# EAGLE design GlucometerV2.1 (EAGLE 7.2.0)
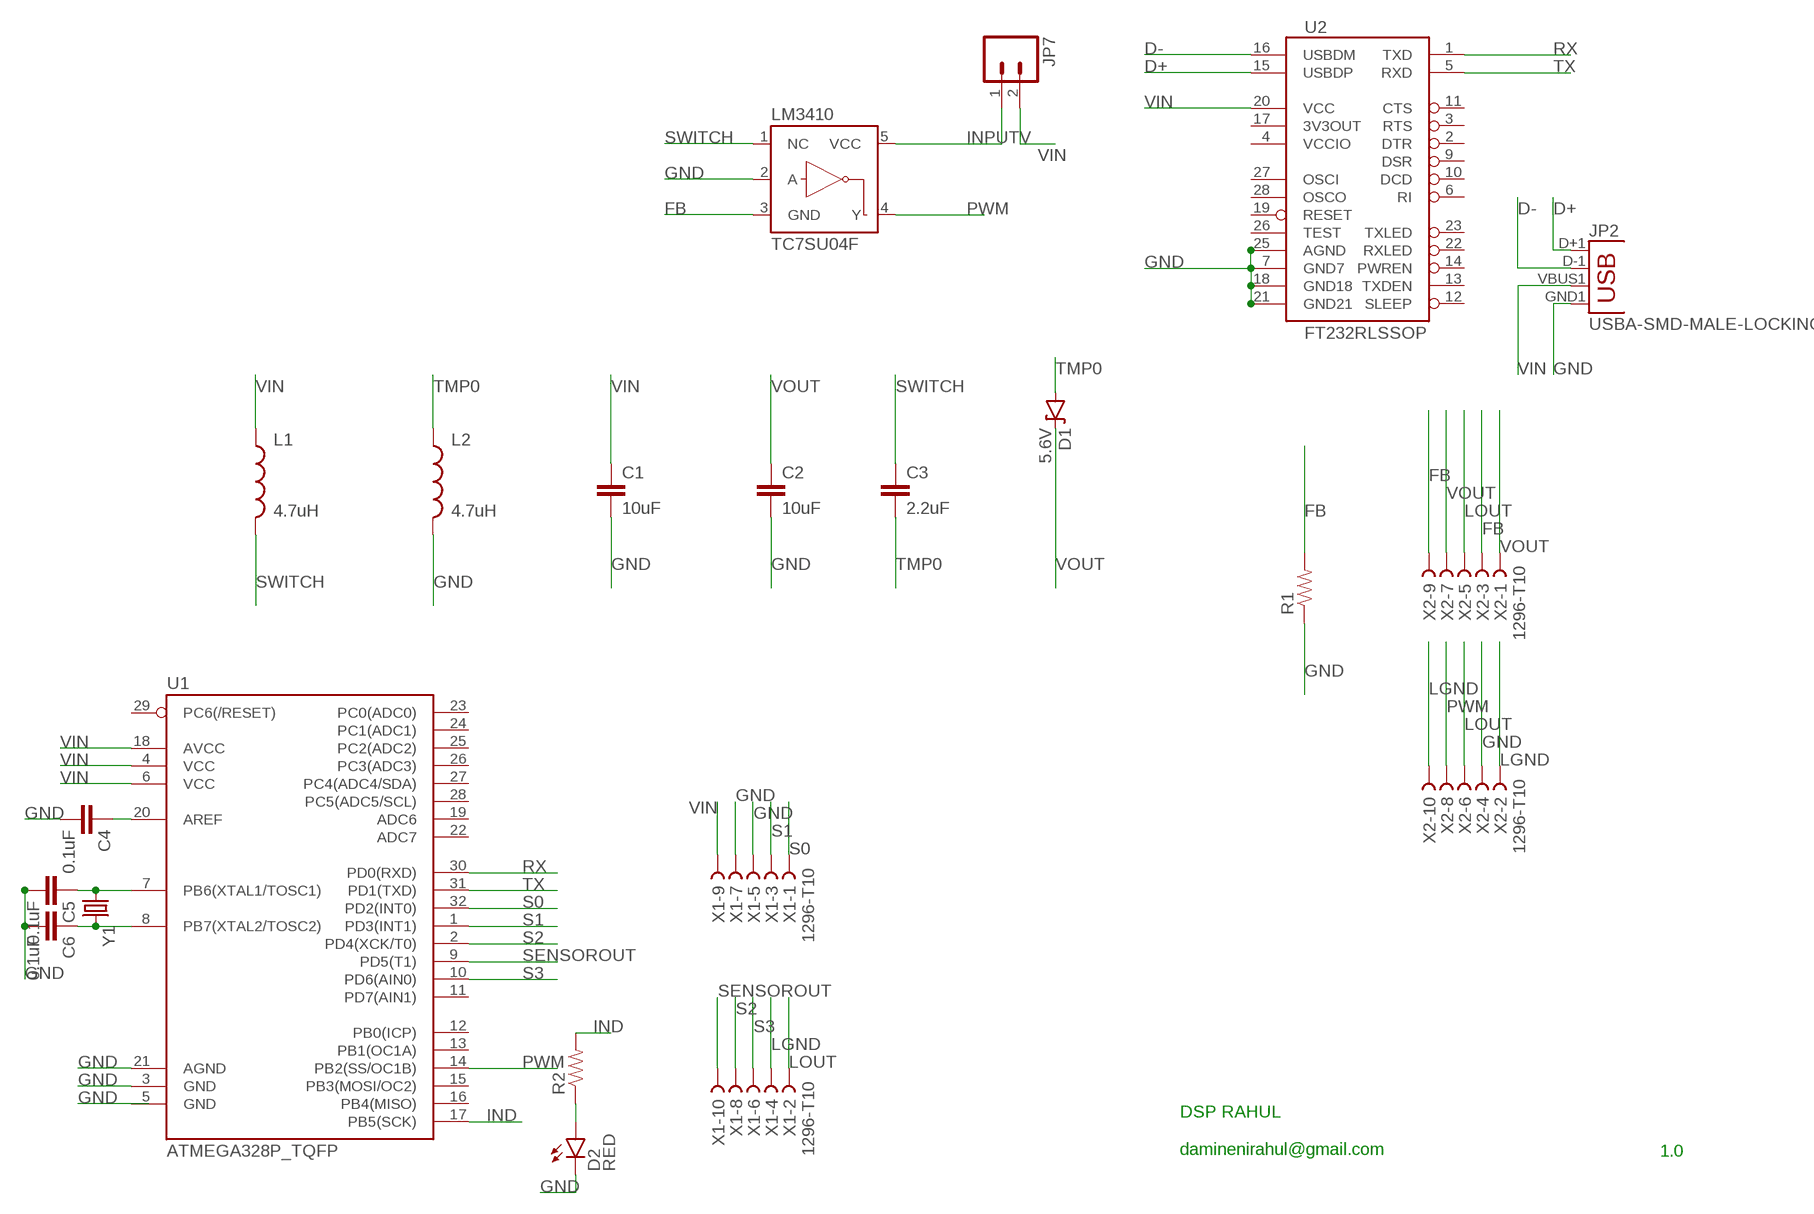
[diagram p0: schematic, sheet 1]

## Parts
C1  10uF  CAP1206  [1206]
C2  10uF  CAP1206  [1206]
C3  2.2uF  CAP1206  [1206]
C4  0.1uF  0.1UF-25V(+80/-20%)(0603)  [0603-CAP]
C5  0.1uF  0.1UF-25V(+80/-20%)(0603)  [0603-CAP]
C6  0.1uF  0.1UF-25V(+80/-20%)(0603)  [0603-CAP]
D1  5.6V  DIODE-ZENER5.6V  [SOD-323]
D2  RED  LED-RED1206  [LED-1206]
JP2  USBA-SMD-MALE-LOCKING  [USB-A-SMT-MALE-LOCKING]
JP7  M02POLAR_LOCK  [MOLEX-1X2_LOCK]
L1  4.7uH  INDUCTOR30OHM,1.8A  [0603]
L2  4.7uH  INDUCTOR30OHM,1.8A  [0603]
LM3410  TC7SU04F  INVERTER_SOT23-5  [SOT23-5]
R1  RESISTOR1206  [1206]
R2  RESISTOR1206  [1206]
U1  ATMEGA328P_TQFP  [TQFP32-08]
U2  FT232RLSSOP  [SSOP28DB]
X1  1296-T10  [1296-10]
X2  1296-T10  [1296-10]
Y1  CRYSTALHC49UV  [HC49U-V]

## Nets
D+: JP2.D+1(D+) U2.15(USBDP)
D-: JP2.D-1(D-) U2.16(USBDM)
FB: LM3410.3(GND) R1.2 X2.3 X2.9
GND: C1.2 C2.2 C4.2 C5.2 C6.2 D2.C JP2.GND1(GND) L2.2 LM3410.2(A) R1.1 U1.3(GND) U1.21(AGND) U2.7(GND7) U2.18(GND18) U2.21(GND21) U2.25(AGND) X1.5 X1.7 X2.4
IND: R2.2 U1.17(PB5(SCK))
INPUTV: JP7.1 LM3410.5(VCC)
LGND: X1.4 X2.2 X2.10
LOUT: X1.2 X2.5 X2.6
N$1: C4.1 U1.20(AREF)
N$2: D2.A R2.1
N$3: C5.1 U1.7(PB6(XTAL1/TOSC1)) Y1.1
N$5: C6.1 U1.8(PB7(XTAL2/TOSC2)) Y1.2
PWM: LM3410.4(Y) U1.14(PB2(SS/OC1B)) X2.8
RX: U1.30(PD0(RXD)) U2.1(TXD)
S0: U1.32(PD2(INT0)) X1.1
S1: U1.1(PD3(INT1)) X1.3
S2: U1.2(PD4(XCK/T0)) X1.8
S3: U1.10(PD6(AIN0)) X1.6
SENSOROUT: U1.9(PD5(T1)) X1.10
SWITCH: C3.1 L1.2 LM3410.1(NC)
TMP0: C3.2 D1.A L2.1
TX: U1.31(PD1(TXD)) U2.5(RXD)
VIN: C1.1 JP2.VBUS1(VBUS) JP7.2 L1.1 U1.4(VCC) U1.6(VCC) U1.18(AVCC) U2.20(VCC) X1.9
VOUT: C2.1 D1.C X2.1 X2.7
Unconnected: U1.5(GND) U1.11(PD7(AIN1)) U1.12(PB0(ICP)) U1.13(PB1(OC1A)) U1.15(PB3(MOSI/OC2)) U1.16(PB4(MISO)) U1.19(ADC6) U1.22(ADC7) U1.23(PC0(ADC0)) U1.24(PC1(ADC1)) U1.25(PC2(ADC2)) U1.26(PC3(ADC3)) U1.27(PC4(ADC4/SDA)) U1.28(PC5(ADC5/SCL)) U1.29(PC6(/RESET)) U2.2(DTR) U2.3(RTS) U2.6(RI) U2.9(DSR) U2.10(DCD) U2.11(CTS) U2.12(SLEEP) U2.13(TXDEN) U2.14(PWREN) U2.17(3V3OUT) U2.19(RESET) U2.22(RXLED) U2.23(TXLED) U2.26(TEST) U2.27(OSCI) U2.28(OSCO)

## Notes on the sheet
- 1.0
- DSP RAHUL
  
  daminenirahul@gmail.com

## Power pins joined to a net without a drawn wire
VCCIO: U2.4(VCCIO)

## Library data of the parts
C1-C3 = SparkFun-Passives:CAP: Capacitor Standard 0603 ceramic capacitor, and 0.1" leaded capacitor.
C4-C6 = SparkFun-Capacitors:0.1UF-25V(+80/-20%)(0603): CAP-00810 Ceramic Standard decoupling cap; PROD_ID: CAP-00810
D1 = SparkFun-DiscreteSemi:DIODE-ZENER: Zener Diode Production Part - 8199 3.4V Zener Voltage; PROD_ID: DIO-12442
D2 = SparkFun-LED:LED-RED: Assorted Red LEDs LilyPad 1206- DIO-09912 1206- DIO-00809 0603- DIO-00819 "SMART" means more efficient and expensive; PROD_ID: DIO-00809
JP2 = SparkFun-Connectors:USB: USB Connectors USB-B-PTH is fully proven SKU : PRT-00139/CONN-08278 USB-miniB is fully proven SKU : PRT-00587 USB-A-PCB is untested. USB-A-H is throughly reviewed, but untested. Spark Fun Electronics SKU : PRT-00437 USB-B-SMT is throughly reviewed, but untested. Needs silkscreen touching up. USB-A-S has not been used/tested USB-MB-H has not been used/tested USB-MICROB has been used. CONN-09505
JP7 = SparkFun-Connectors:M02: Standard 2-pin 0.1" header. Use with - straight break away headers ( PRT-00116) - right angle break away headers (PRT-00553) - swiss pins (PRT-00743) - machine pins (PRT-00117) - female headers (PRT-00115) Molex polarized connector foot print use with: PRT-08233 with associated crimp pins and housings. 2.54_SCREWTERM for use with PRT-10571. 3.5mm Screw Terminal footprints for PRT-08084 5mm Screw Terminal footprints for use with PRT-08432
L1 L2 = SparkFun-Passives:INDUCTOR: Inductors Basic Inductor/Choke - 0603 and 1206. Footprints are not proven and vary greatly between part numbers. INDUCTOR POWER 3.3UH 4.0A SMD 0.197" L x 0.197" W x 0.177" H (5.00mm x 5.00mm x 4.50mm); PROD_ID: RES-07859
LM3410 = SparkFun-DigitalIC:INVERTER: Single inverter, SOT23-5; NOTE: RETIRED; PROD_ID: 8211
R1 R2 = SparkFun-Resistors:RESISTOR: Resistor Basic schematic elements and footprints for 0603, 1206, and PTH resistors.
U1 = SparkFun-DigitalIC:ATMEGA328P_TQFP; PROD_ID: IC-09069
U2 = SparkFun-DigitalIC:FT232RL: USB UART FT232RL 4th Generation USB UART (USB <-> Serial) Controller. Spark Fun Electronics SKU : COM-00650 Production SKU IC-00870; PROD_ID: IC-00870
X1 X2 = con-leotronics:1296-T10: 1.27mm SINGLE ROW FEMALE SOCKET Source: http://www.leotronics.co.uk/Conexcon/Data%20Sheets/sec.%20A/1296ing.pdf; OC_FARNELL: unknown; OC_NEWARK: unknown
Y1 = SparkFun-FreqCtrl:CRYSTAL: Various standard crystals. Proven footprints.

## Board
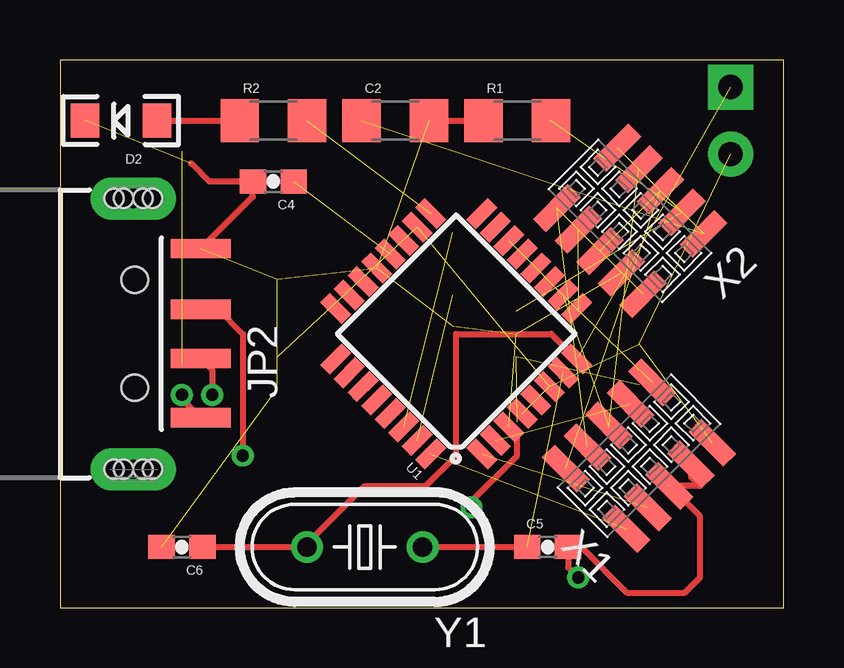
[diagram p1: board, top side]
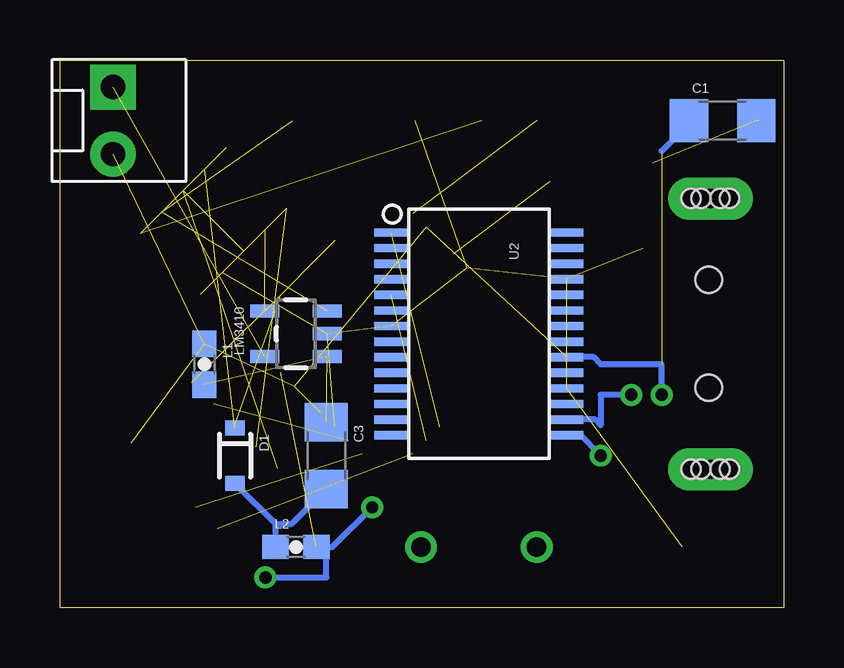
[diagram p2: board, bottom side, seen from below]

Size 30.15 x 22.85 mm. Coordinates in mm from the lower left corner, seen from the top.
Outline: 0,0 30.15,0 30.15,22.85 0,22.85 0,0
Copper layers (1*16): Top 0.035mm / dielectric 1.5mm / Bottom 0.035mm
Design rules "default": minimum track width 10mil, minimum drill 24mil, track to track 8mil, track to pad 8mil, pad to pad 8mil, via to via 8mil, smd to smd 8mil, copper to edge 40mil, drill to drill 8mil, minimum pad ring 10mil, minimum via ring 8mil, stop-mask expansion 4mil, vias tented up to drill 0mil, thermal gap 10mil

### Footprints (pad centres in the part's own frame; a part is rotated, then mirrored left to right if it is on the bottom)
1206 = smd 1.6 x 1.8: 1 -1.4,0; 2 1.4,0
0603-CAP = smd 1.1 x 1: 1 -0.85,0; 2 0.85,0
SOD-323 = smd 0.63 x 0.83: A 1.15,0; C -1.15,0
LED-1206 = smd 1.2 x 1.4: A -1.5,0; C 1.5,0
USB-A-SMT-MALE-LOCKING = smd 0.8 x 2.5: D+1 1.027,-5.87; D-1 -1.027,-5.87; GND1 3.551,-5.87; VBUS1 -3.5,-5.87 | drill 0.8 pad 1.778 long: P$1 5.647,-3.05; P$3 -5.647,-3.05 | hole 1.1: 2.25,-3.12; -2.25,-3.12 | hole 0.8: -5.647,-3.45; -5.647,-3.85; -5.647,-2.65; -5.647,-2.25; 5.647,-3.45; 5.647,-3.85; 5.647,-2.65; 5.647,-2.25
MOLEX-1X2_LOCK = drill 1.016 pad 1.88 square: 1 -0.127,0 | drill 1.016 pad 1.88: 2 2.667,0
0603 = smd 1.1 x 1: 1 -0.85,0; 2 0.85,0
SOT23-5 = smd 0.55 x 1.2: 1 -0.95,-1.3; 2 0,-1.3; 3 0.95,-1.3; 4 0.95,1.3; 5 -0.95,1.3
TQFP32-08 = smd 1.27 x 0.559: 1 -4.293,2.8; 2 -4.293,2; 3 -4.293,1.2; 4 -4.293,0.4; 5 -4.293,-0.4; 6 -4.293,-1.2; 7 -4.293,-2; 8 -4.293,-2.8; 17 4.293,-2.8; 18 4.293,-2; 19 4.293,-1.2; 20 4.293,-0.4; 21 4.293,0.4; 22 4.293,1.2; 23 4.293,2; 24 4.293,2.8 | smd 0.559 x 1.27: 9 -2.8,-4.293; 10 -2,-4.293; 11 -1.2,-4.293; 12 -0.4,-4.293; 13 0.4,-4.293; 14 1.2,-4.293; 15 2,-4.293; 16 2.8,-4.293; 25 2.8,4.293; 26 2,4.293; 27 1.2,4.293; 28 0.4,4.293; 29 -0.4,4.293; 30 -1.2,4.293; 31 -2,4.293; 32 -2.8,4.293
SSOP28DB = smd 0.348 x 1.397: 1 -4.225,-3.656; 2 -3.575,-3.656; 3 -2.925,-3.656; 4 -2.275,-3.656; 5 -1.625,-3.656; 6 -0.975,-3.656; 7 -0.325,-3.656; 8 0.325,-3.656; 9 0.975,-3.656; 10 1.625,-3.656; 11 2.275,-3.656; 12 2.925,-3.656; 13 3.575,-3.656; 14 4.225,-3.656; 15 4.225,3.656; 16 3.575,3.656; 17 2.925,3.656; 18 2.275,3.656; 19 1.625,3.656; 20 0.975,3.656; 21 0.325,3.656; 22 -0.325,3.656; 23 -0.975,3.656; 24 -1.625,3.656; 25 -2.275,3.656; 26 -2.925,3.656; 27 -3.575,3.656; 28 -4.225,3.656
1296-10 = smd 0.76 x 2.05: 1 -2.54,-1.78; 2 -2.54,1.78; 3 -1.27,-1.78; 4 -1.27,1.78; 5 0,-1.78; 6 0,1.78; 7 1.27,-1.78; 8 1.27,1.78; 9 2.54,-1.78; 10 2.54,1.78
HC49U-V = drill 0.813: 1 -2.413,0; 2 2.413,0

### Placement (x,y rotation side)
C1  2.54,20.32 0 bottom
C2  13.97,20.32 0 top
C3  19.05,6.35 270 bottom
C4  8.89,17.78 180 top
C5  20.32,2.54 0 top
C6  5.08,2.54 180 top
D1  22.86,6.35 270 bottom
D2  2.54,20.32 180 top
JP2  0,11.43 90 top
JP7  27.94,21.59 270 bottom
L1  24.13,10.16 270 bottom
L2  20.32,2.54 0 bottom
LM3410  20.32,11.43 90 bottom
R1  19.05,20.32 0 top
R2  8.89,20.32 0 top
U1  16.51,11.43 135 top
U2  12.7,11.43 270 bottom
X1  24.13,6.35 45 top
X2  23.76,16.14 135 top
Y1  12.7,2.54 180 top

### Tracks (layer width: path | path; a pad name or v marks a point on that pad's centre or on a via)
D+  (via drill 0.51)
  Top 0.254: JP2.D+1 6.59,12.46 7.62,11.43 v7.62,6.35
  Bottom 0.254: v7.62,6.35 8.47,7.21 U2.15
D-  (via drill 0.51)
  Top 0.254: JP2.D-1 6.35,9.92 v6.35,8.89
  Bottom 0.254: v6.35,8.89 7.62,8.89 7.62,7.62 7.86,7.86 U2.16
FB  (3 unrouted)
GND  (via drill 0.51)  (13 unrouted)
  Top 0.254: JP2.GND1 8.04,17.15 C4.2 6.22,17.78 5.46,18.54 | C2.2 R1.1 | v21.59,1.27 21.17,1.69 C5.2 21.72,2.54 23.62,0.64 26.04,0.64 26.67,1.27 26.67,3.81 X1.5 | X1.7 26.29,5.46 26.67,5.08 X1.5 | v17.14,4.19 17.14,4.45 19.05,6.35 19.05,7.19 U1.3
  Bottom 0.254: v21.59,1.27 19.05,1.27 19.05,2.12 L2.2 18.8,2.54 v17.14,4.19
IND  (1 unrouted)
INPUTV  (1 unrouted)
LGND  (2 unrouted)
LOUT  (2 unrouted)
N$1  (1 unrouted)
N$2
  Top 0.254: D2.A R2.1
N$3  (1 unrouted)
  Top 0.254: Y1.1 C5.1
N$5
  Top 0.254: C6.1 Y1.2 10.29,2.67 12.7,5.08 15.24,5.08 16.51,6.35 16.51,11.43 20.47,11.43 U1.8
PWM  (2 unrouted)
RX  (1 unrouted)
S0  (1 unrouted)
S1  (1 unrouted)
S2  (1 unrouted)
S3  (1 unrouted)
SENSOROUT  (1 unrouted)
SWITCH  (2 unrouted)
TMP0
  Bottom 0.254: L2.1 21.17,3.51 | 21.17,3.51 D1.A | 21.17,3.51 20.49,3.51 C3.2
TX  (1 unrouted)
VIN  (via drill 0.51)  (7 unrouted)
  Top 0.254: JP2.VBUS1 5.08,8.72 v5.08,8.89
  Bottom 0.254: v5.08,8.89 5.08,10.16 7.62,10.16 7.92,10.46 U2.20 | C1.1 3.94,20.19 5.08,19.05
VOUT  (3 unrouted)